# EAGLE design Arduino_DALIMaster (EAGLE 7.4.0)
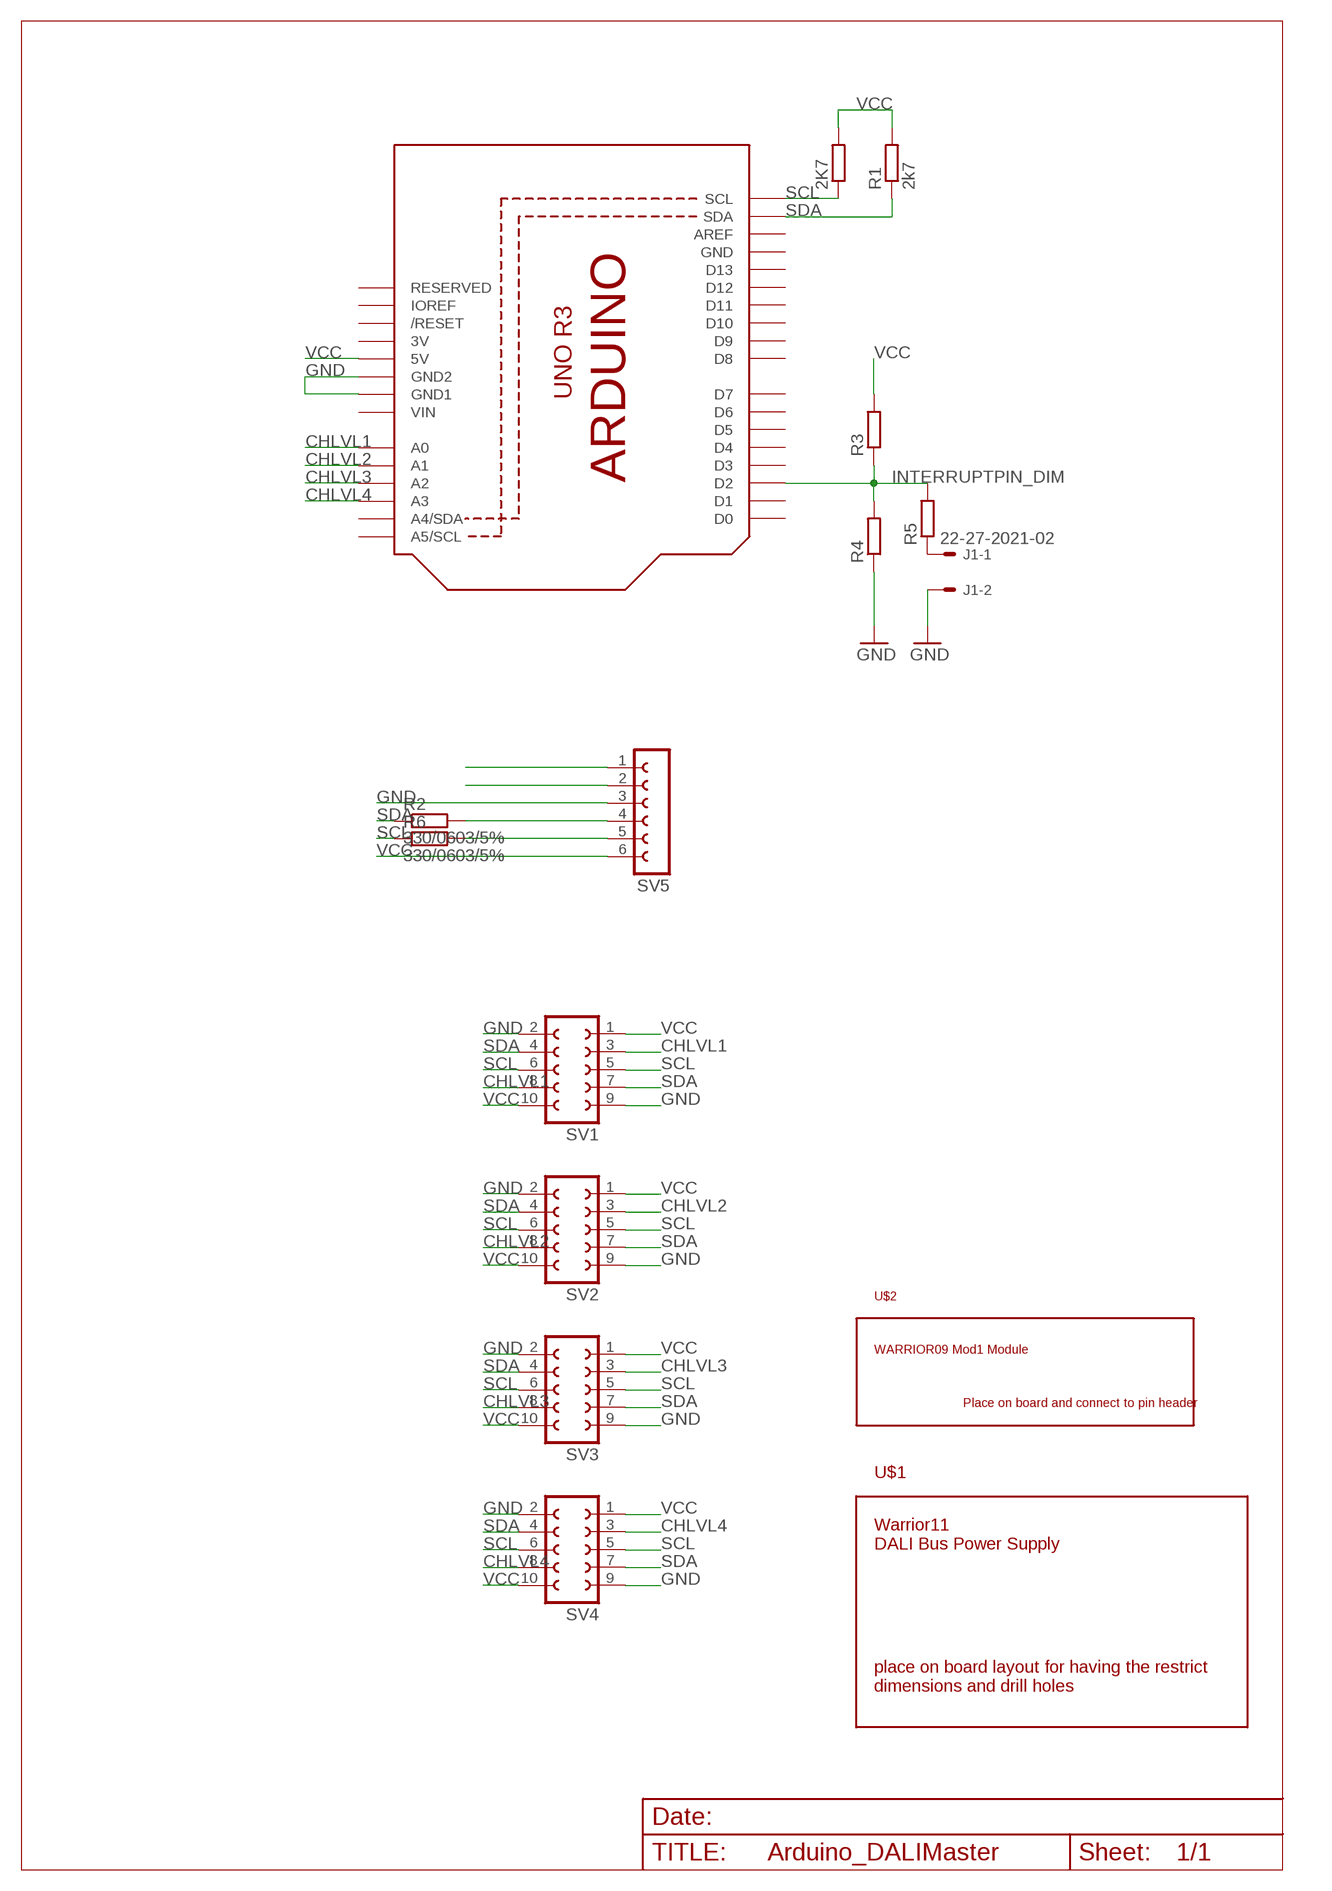
[diagram p0: schematic, sheet 1]

## Parts
2K7  R-EU_R0603  [R0603]
J1  22-27-2021-02  [6410-02]
R1  2k7  R-EU_R0603  [R0603]
R2  330/0603/5%  R-EU_R0603  [R0603]
R3  R-EU_R0603  [R0603]
R4  R-EU_R0603  [R0603]
R5  R-EU_R0603  [R0603]
R6  330/0603/5%  R-EU_R0603  [R0603]
SV1  FE05-2  [FE05-2]
SV2  FE05-2  [FE05-2]
SV3  FE05-2  [FE05-2]
SV4  FE05-2  [FE05-2]
SV5  FE06-1  [FE06]
U1  ARDUINOR3-BPLACE  [ARDUINOR3-BPLACE]
U$1  WARRIOR11  [WARRIOR11]
U$2  WARRIOR09MOD1  [WARRIOR09]

## Nets
CHLVL1: SV1.3 SV1.8 U1.A0
CHLVL2: SV2.3 SV2.8 U1.A1
CHLVL3: SV3.3 SV3.8 U1.A2
CHLVL4: SV4.3 SV4.8 U1.A3
GND: J1.2 R4.1 SV1.2 SV1.9 SV2.2 SV2.9 SV3.2 SV3.9 SV4.2 SV4.9 SV5.3 U1.GND1 U1.GND2
INTERRUPTPIN_DIM: R3.1 R4.2 R5.2 U1.D2
N$1: J1.1 R5.1
N$2: SV5.1
N$3: SV5.2
N$5: R2.2 SV5.4
N$6: R6.2 SV5.5
SCL: 2K7.1 R6.1 SV1.5 SV1.6 SV2.5 SV2.6 SV3.5 SV3.6 SV4.5 SV4.6 U1.SCL
SDA: R1.1 R2.1 SV1.4 SV1.7 SV2.4 SV2.7 SV3.4 SV3.7 SV4.4 SV4.7 U1.SDA
VCC: 2K7.2 R1.2 R3.2 SV1.1 SV1.10 SV2.1 SV2.10 SV3.1 SV3.10 SV4.1 SV4.10 SV5.6 U1.5V
Unconnected: U1.A4(A4/SDA) U1.A5(A5/SCL) U1.AREF U1.D0 U1.D1 U1.D3 U1.D4 U1.D5 U1.D6 U1.D7 U1.D8 U1.D9 U1.D10 U1.D11 U1.D12 U1.D13 U1.IOREF U1.RESERVED U1.RESET(/RESET)

## Power pins joined to a net without a drawn wire
3V: U1.3V
GND: U1.GND
VIN: U1.VIN

## Library data of the parts
2K7 R1-R6 = rcl:R-EU_: RESISTOR, European symbol
J1 = con-molex:22-?-02: CONNECTOR wire to board 2.54 mm (.1 inch) pitch header; OC_FARNELL: unknown; OC_NEWARK: unknown
SV1-SV4 = con-lsta:FE05-2: FEMALE HEADER; OC_FARNELL: unknown; OC_NEWARK: unknown
SV5 = con-lsta:FE06-1: FEMALE HEADER; OC_FARNELL: unknown; OC_NEWARK: unknown
U1 = adafruit:ARDUINOR3: This is a new object for the new Arduino R3 - with extra pins that you may want to use (such as IOref, and duplicated A4/A5
U$1 = codemercs:WARRIOR11
U$2 = codemercs:WARRIOR09MOD1

## Board
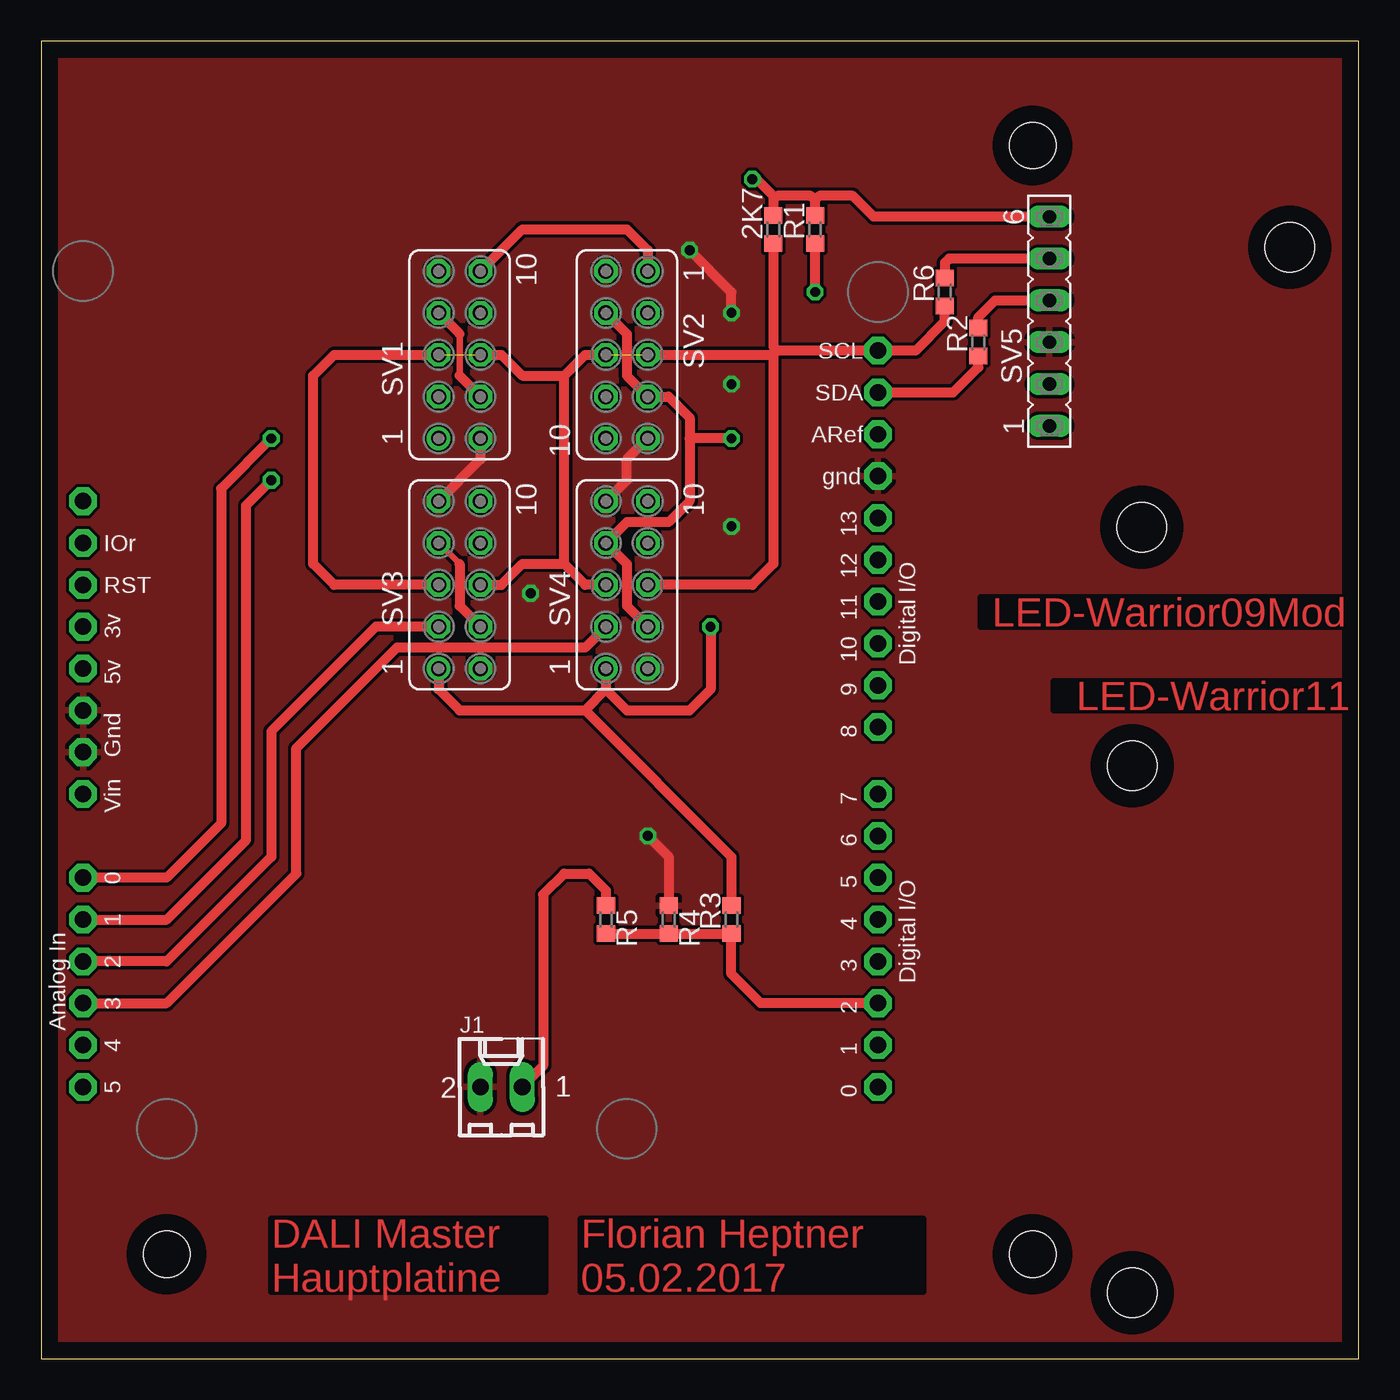
[diagram p1: board, top side]
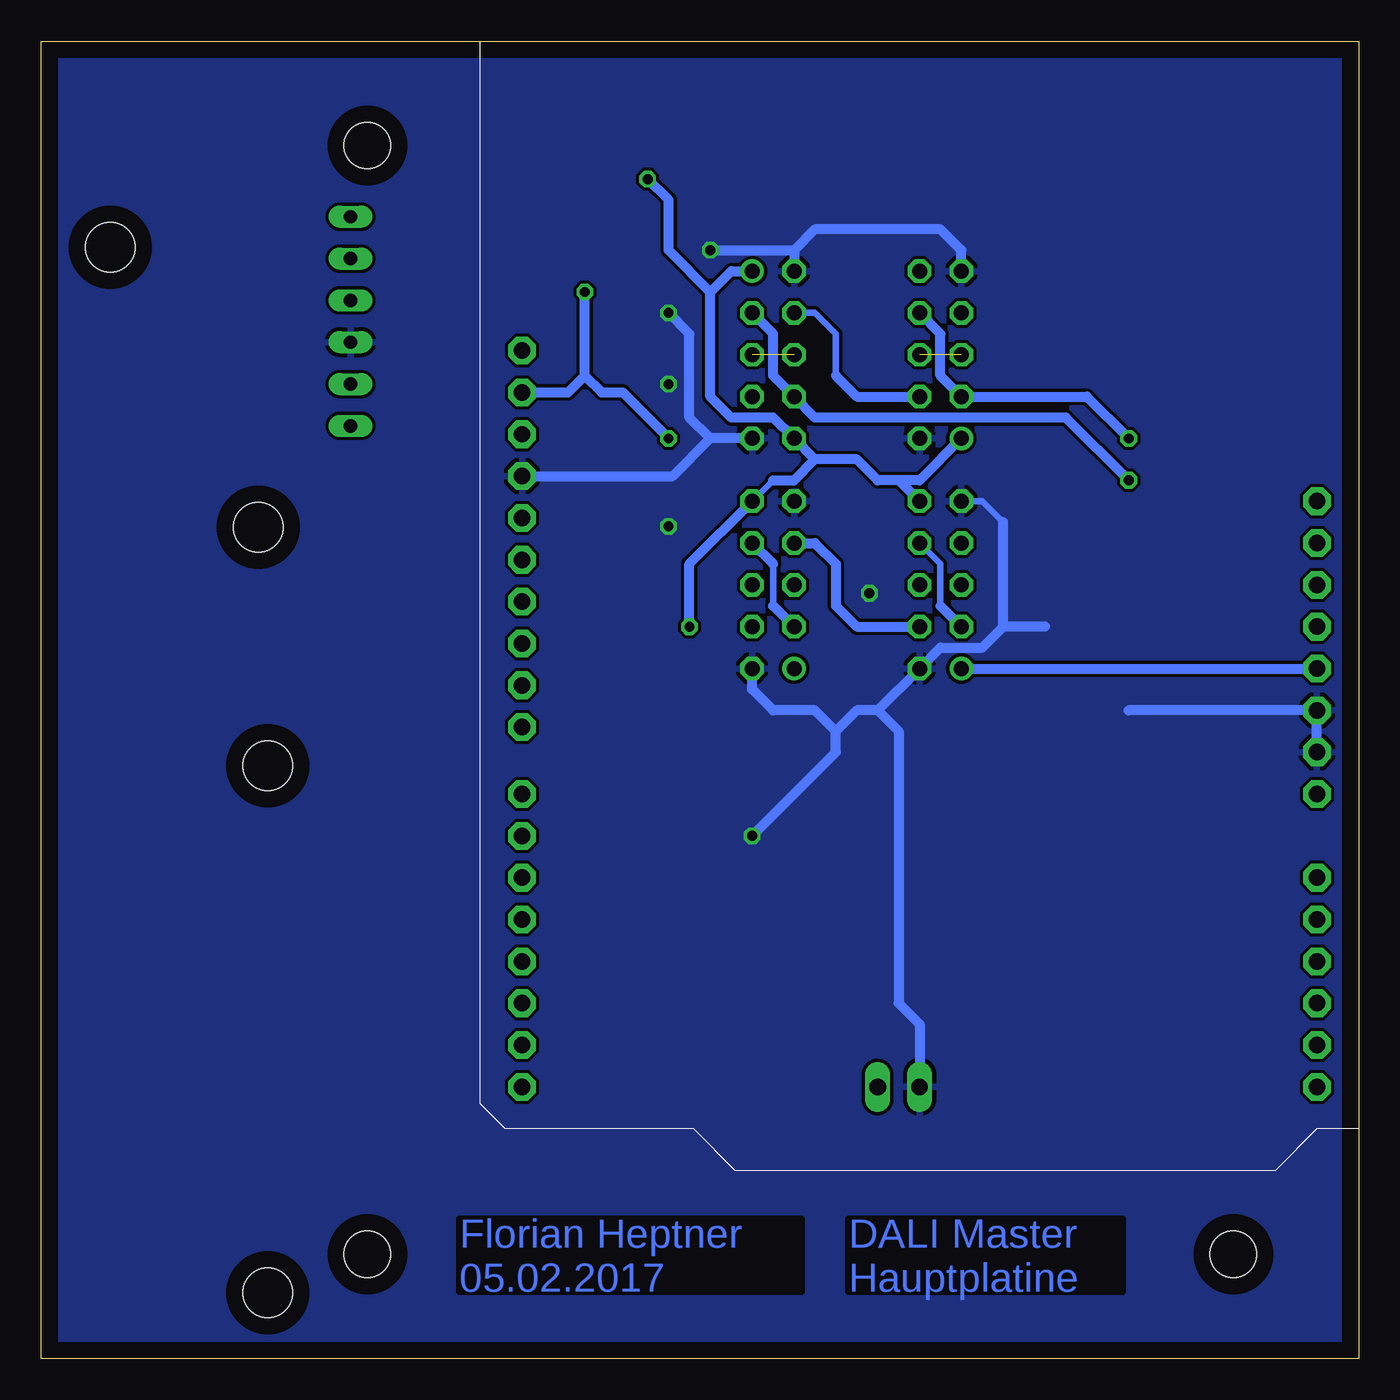
[diagram p2: board, bottom side, seen from below]

Size 80 x 80 mm. Coordinates in mm from the lower left corner, seen from the top.
Outline: 0,0 80,0 80,80 0,80 0,0
Copper layers (1*16): Top 0.035mm / dielectric 1.5mm / Bottom 0.035mm
Design rules "default": minimum track width 10mil, minimum drill 24mil, track to track 8mil, track to pad 8mil, pad to pad 8mil, via to via 8mil, smd to smd 8mil, copper to edge 40mil, drill to drill 8mil, minimum pad ring 10mil, minimum via ring 8mil, stop-mask expansion 4mil, vias tented up to drill 0mil, thermal gap 10mil
Holes 2.8 mm at 60.2,6.35 60.2,73.66 7.62,6.35

### Footprints (pad centres in the part's own frame; a part is rotated, then mirrored left to right if it is on the bottom)
R0603 = smd 1 x 1.1: 1 -0.85,0; 2 0.85,0
6410-02 = drill 1.016 long: 1 1.27,0; 2 -1.27,0
FE05-2 = drill 0.914: 1 -5.08,1.27 | drill 0.914 octagon: 2 -5.08,-1.27; 3 -2.54,1.27; 4 -2.54,-1.27; 5 0,1.27; 6 0,-1.27; 7 2.54,1.27; 8 2.54,-1.27; 9 5.08,1.27; 10 5.08,-1.27
FE06 = drill 0.813 long: 1 -6.35,0; 2 -3.81,0; 3 -1.27,0; 4 1.27,0; 5 3.81,0; 6 6.35,0
ARDUINOR3-BPLACE = drill 1 pad 1.676 octagon: 3V -1.27,-24.13; 5V 1.27,-24.13; A0 13.97,-24.13; A1 16.51,-24.13; A2 19.05,-24.13; A3 21.59,-24.13; A4 24.13,-24.13; A5 26.67,-24.13; AREF -12.954,24.13; D0 26.67,24.13; D1 24.13,24.13; D2 21.59,24.13; D3 19.05,24.13; D4 16.51,24.13; D5 13.97,24.13; D6 11.43,24.13; D7 8.89,24.13; D8 4.826,24.13; D9 2.286,24.13; D10 -0.254,24.13; D11 -2.794,24.13; D12 -5.334,24.13; D13 -7.874,24.13; GND -10.414,24.13; GND1 6.35,-24.13; GND2 3.81,-24.13; IOREF -6.35,-24.13; RESERVED -8.89,-24.13; RESET -3.81,-24.13; SCL -18.034,24.13; SDA -15.494,24.13; VIN 8.89,-24.13
WARRIOR11 = hole 3: 3,35; 44,35; 44,3; 3,3
WARRIOR09 = hole 3: 23.5,11.5; 32.5,28.5

### Placement (x,y rotation side)
2K7  44.45,68.58 90 top
J1  27.94,16.51 0 top
R1  46.99,68.58 90 top
R2  56.9,61.72 90 top
R3  41.91,26.67 90 top
R4  38.1,26.67 270 top
R5  34.29,26.67 270 top
R6  54.86,64.77 90 top
SV1  25.4,60.96 90 top
SV2  35.56,60.96 270 top
SV3  25.4,46.99 90 top
SV4  35.56,46.99 90 top
SV5  61.21,62.99 90 top
U1  26.67,43.18 270 top
U$1  63.25,1.02 0 top
U$2  99.31,78.99 180 top

### Tracks (layer width: path | path; a pad name or v marks a point on that pad's centre or on a via)
CHLVL1  (via drill 0.6)
  Top 0.61: U1.A0 7.62,29.21 10.92,32.51 10.92,52.83 v13.97,55.88
  Bottom 0.61: SV1.8 25.4,62.23 25.4,59.69 SV1.3 16.51,58.42 v13.97,55.88
CHLVL2  (via drill 0.6)
  Top 0.61: U1.A1 7.62,26.67 12.45,31.5 12.45,51.82 v13.97,53.34
  Bottom 0.61: SV2.3 35.56,62.23 35.56,59.69 SV2.8 33.02,57.15 17.78,57.15 v13.97,53.34
CHLVL3
  Top 0.61: SV3.3 20.32,44.45 13.97,38.1 13.97,30.48 7.62,24.13 U1.A2
  Bottom 0.406: SV3.8 25.4,48.26 25.4,45.72
  Bottom 0.61: 25.4,45.72 SV3.3
CHLVL4
  Top 0.61: SV4.3 33.02,43.18 21.59,43.18 15.49,37.08 15.49,29.46 7.62,21.59 U1.A3
  Bottom 0.406: 35.56,48.26 35.56,45.72
  Bottom 0.61: SV4.8 35.56,48.26 | 35.56,45.72 SV4.3
GND  (via drill 0.6)
  Top 0.61: SV1.2 26.67,54.61 SV3.9 | SV4.9 35.56,53.34 35.56,54.61 SV2.9 | v41.91,63.5 41.91,64.77 v39.37,67.31 | v36.83,31.75 38.1,30.48 R4.1
  Bottom 0.406: 21.59,50.8 22.86,52.07 SV3.9
  Bottom 0.61: SV1.9 24.13,67.31 25.4,68.58 33.02,68.58 34.29,67.31 | 34.29,67.31 SV2.2 | 29.21,39.37 SV3.2 25.4,43.18 22.86,43.18 21.59,44.45 | 29.21,39.37 30.48,39.37 31.75,38.1 | 31.75,38.1 33.02,39.37 35.56,39.37 36.83,40.64 SV4.2 | SV2.9 39.37,55.88 | 39.37,55.88 40.64,57.15 40.64,62.23 v41.91,63.5 | 21.59,44.45 21.59,50.8 | U1.GND 41.66,53.59 39.37,55.88 | 13.97,39.37 U1.GND2 U1.GND1 | 19.05,44.45 21.59,44.45 | 29.21,39.37 27.94,38.1 27.94,21.59 26.67,20.32 J1.2 | v36.83,31.75 31.75,36.83 31.75,38.1 | v39.37,67.31 34.29,67.31
  other vias: 41.91,59.18 41.91,50.55 29.72,46.48
  pour Bottom: 0,80.01 100.33,80.01 100.33,0 0,0
  pour Top: 0,80.01 100.33,80.01 100.33,0 0,0
INTERRUPTPIN_DIM
  Top 0.61: R5.2 R4.2 R3.1 41.91,23.37 43.69,21.59 U1.D2
N$1
  Top 0.61: J1.1 30.48,17.78 30.48,28.19 31.75,29.46 33.27,29.46 34.29,28.45 R5.1
N$5
  Top 0.61: R2.2 56.9,63.25 57.91,64.26 SV5.4
N$6
  Top 0.61: SV5.5 55.12,66.8 54.86,66.55 R6.2
SCL  (2 unrouted)
  Top 0.61: SV3.5 17.78,46.99 16.51,48.26 16.51,59.69 17.78,60.96 SV1.5 | SV2.5 44.45,60.96 | 44.45,60.96 44.45,48.26 43.18,46.99 SV4.6 | SV4.5 33.02,46.99 31.75,48.26 | 31.75,48.26 31.75,59.69 | 31.75,59.69 33.02,60.96 SV2.6 | SV1.6 27.94,60.96 29.21,59.69 31.75,59.69 | SV3.6 27.94,46.99 29.21,48.26 31.75,48.26 | 44.7,61.21 U1.SCL 53.09,61.21 54.86,62.99 R6.1 | 44.7,61.21 44.45,60.96 | 2K7.1 44.45,61.47 44.7,61.21
SDA  (via drill 0.6)
  Top 0.406: 25.4,59.69 25.4,62.23 | SV3.7 25.4,48.26
  Top 0.61: SV1.4 25.4,59.69 | 25.4,62.23 SV1.7 | SV2.4 35.56,62.23 35.56,59.69 SV2.7 38.1,58.42 39.37,57.15 39.37,55.88 | SV4.4 35.56,45.72 35.56,48.26 SV4.7 35.56,50.8 38.1,50.8 39.37,52.07 39.37,55.88 | 25.4,48.26 25.4,45.72 SV3.4 | v41.91,55.88 39.37,55.88 | v46.99,64.77 R1.1 | U1.SDA 55.37,58.67 56.9,60.2 R2.1
  Bottom 0.406: SV2.4 33.02,63.5 31.75,62.23 31.75,59.69
  Bottom 0.61: SV4.7 33.02,49.53 31.75,48.26 31.75,45.72 30.48,44.45 SV3.4 | 31.75,59.69 30.48,58.42 SV1.4 | U1.SDA 48.01,58.67 46.99,59.69 | 46.99,59.69 45.97,58.67 44.7,58.67 v41.91,55.88 | 46.99,59.69 v46.99,64.77
VCC  (via drill 0.6, 0.6 pad 1.02)
  Top 0.61: SV1.10 29.21,68.58 35.56,68.58 36.83,67.31 SV2.1 | SV3.1 24.13,40.64 25.4,39.37 33.02,39.37 | 33.02,39.37 34.29,40.64 | 33.02,39.37 41.91,30.48 R3.2 | SV4.1 34.29,40.64 | 34.29,40.64 35.56,39.37 39.37,39.37 40.64,40.64 v40.64,44.45 | v43.18,71.63 43.43,71.63 44.45,70.61 44.45,70.36 | 44.45,70.36 2K7.2 | R1.2 46.99,70.36 | 46.99,70.36 46.74,70.61 44.7,70.61 44.45,70.36 | SV5.6 50.55,69.34 49.28,70.61 47.24,70.61 46.99,70.36
  Bottom 0.406: SV4.10 35.56,53.34
  Bottom 0.61: SV3.10 27.94,53.34 | 27.94,53.34 29.21,53.34 30.48,54.61 33.02,54.61 | 33.02,54.61 SV2.10 35.56,57.15 38.1,57.15 39.37,58.42 39.37,64.77 | 35.56,53.34 34.29,53.34 33.02,54.61 | SV1.1 26.67,53.34 27.94,53.34 | 39.37,64.77 38.1,66.04 SV2.1 | 39.37,64.77 41.91,67.31 41.91,70.36 v43.18,71.63 | SV3.1 U1.5V | v40.64,44.45 40.64,48.26 SV4.10

### Text on the board
Top: LED-Warrior09Mod | LED-Warrior11 | DALI Master / Hauptplatine | Florian Heptner / 05.02.2017
Bottom: DALI Master / Hauptplatine | Florian Heptner / 05.02.2017
tStop: LED-Warrior09Mod | LED-Warrior11